# Altium schematic sheet Kill_Switch.SchDoc
size A; SheetNumber: 2; SheetTotal: 6
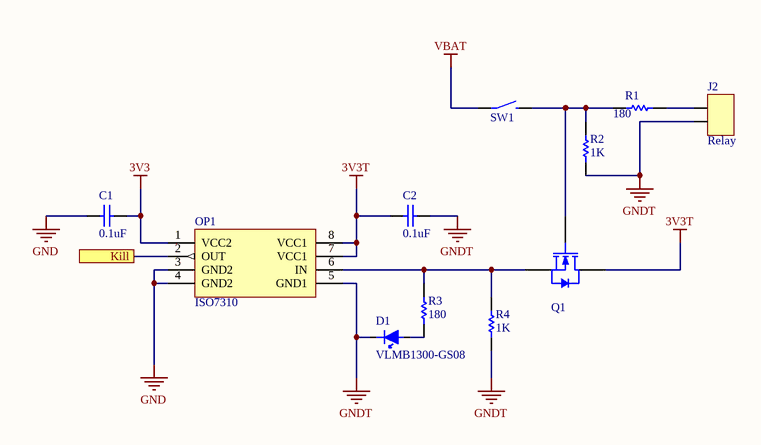
[diagram p0: Kill_Switch.SchDoc]

## Parts
C1  0.1uF  [CAPC1608X97X38NL12T08]
C2  0.1uF  [CAPC1608X97X38NL12T08]
D1  VLMB1300-GS08  [0603 - DIODE]
J2  Relay  [2PinHeader]
OP1  ISO7310  [ISO7310CDR - 8 SOIC]
Q1  MOSFET N-CH  [ONSC-SOT-23-3-318-08_V]  (value not drawn)
R1  180  [RESC1609X55X30NL10T20]
R2  1K  [RESC1609X55X30NL10T20]
R3  180  [RESC1609X55X30NL10T20]
R4  1K  [RESC1609X55X30NL10T20]
SW1  SwitchHeader  [2PinHeader]  (value not drawn)

## Ports
Kill

## Nets
3V3: C1.1 OP1.1(VCC2)
3V3T: C2.1 OP1.7(VCC1) OP1.8(VCC1) Q1.3(D)
GND: C1.2 OP1.3(GND2) OP1.4(GND2)
GNDT: C2.2 D1.C J2.2 OP1.5(GND1) R2.1 R4.1
VBAT: SW1.1
Kill: OP1.2(OUT) ; port Kill
NetD1_A: D1.A R3.1
NetJ2_1: J2.1 R1.2
NetOP1_6: OP1.6(IN) Q1.2(S) R3.2 R4.2
NetQ1_1: Q1.1(G) R1.1 R2.2 SW1.2

## Library data of the parts
C1 C2 = VJ0603Y104KXXAC: CAP CER 0.1UF 25V X7R 0603; Manufacturer: Vitramon; Part Number: VJ0603Y-104KXXAC; Supplier 1: Digi-Key; Supplier Part Number 1: 720-1378-1-ND
D1 = VLMB1300-GS08: Blue 470nm LED Indication - Discrete 3.3V 0603 (1608 Metric); pin to pad: A>1 C>2; Supplier 1: Digi-Key; Supplier Part Number 1: VLMB1300-GS08CT-ND
J2 = 2PinHeader: Supplier 1: Digi-Key; Supplier Part Number 1: 3M9457-36-ND
OP1 = ISO7310CDR - 8SOIC: General Purpose Digital Isolator 3000Vrms 1 Channel 25Mbps 25kV/µs CMTI 8-SOIC (0.154", 3.90mm Width) /; pin to pad: 1>8 2>6 3>7 4>5 5>4 6>2 7>3 8>1; Supplier 1: Digi-Key; Supplier Part Number 1: 296-37994-1-ND
Q1 = BSS138LT1G: MOSFET N-CH 50V 200MA SOT-23; Manufacturer 1: ON Semiconductor; Rds On Max: 3.5R; Max Power Dissipation: 225mW; Input Capacitance: 50pF; Turn-Off Delay Time: 20ns; Gate to Source Voltage (Vgs): 20V; Number of Elements: 1; Element Configuration: Single; Threshold Voltage: 1.5V; Supplier 1: Digi-Key; Supplier Part Number 1: BSS138LT1GOSCT-ND; Manufacturer Part Number 1: BSS138LT1G; Stock 1: 952638; Pricing 1: 1=0.26000, 10=0.21100, 100=0.11210, 500=0.07376, 1000=0.05016 (USD); RoHS: Yes; Case/Package: SOT-23-3; Number of Pins: 3; Contact Plating: Tin,Matte; Min Operating Temperature: -55°C; Max Operating Temperature: 150°C; Packaging: Tape and Reel; Continuous Drain Current (ID): 200mA; Drain to Source Resistance: 3.5R; Package Quantity: 1; Drain to Source Breakdown Voltage: 50V; Power Dissipation: 225mW; Turn-On Delay Time: 20ns; Nominal Vgs: 1.5V; Voltage Rating (DC): 50V; Current Rating: 200mA; On-State Resistance: 3.5R; Length: 3.04mm; Height: 1.01mm; Width: 1.4mm; Radiation Hardening: No; Lead Free: Lead Free; REACH SVHC: No SVHC; Halogen Free: Halogen Free; ComponentLink1URL: https://datasheet.ciiva.com/22641/1596366-22641636.pdf?src-supplier=Element14; ComponentLink1Description: https://datasheet.ciiva.com/22641/1596366-22641636.pdf?src-supplier=Element14; ComponentLink2URL: https://datasheet.ciiva.com/936/bss138lt1-d-936801.pdf?src-supplier=Digi-Key; ComponentLink2Description: https://datasheet.ciiva.com/936/bss138lt1-d-936801.pdf?src-supplier=Digi-Key; ComponentLink3URL: https://datasheet.ciiva.com/936/bss138lt1-d-936802.pdf?src-supplier=Digi-Key; ComponentLink3Description: https://datasheet.ciiva.com/936/bss138lt1-d-936802.pdf?src-supplier=Digi-Key; ComponentLink4URL: https://datasheet.ciiva.com/936/bss138lt1-d-936803.pdf?src-supplier=Digi-Key; ComponentLink4Description: https://datasheet.ciiva.com/936/bss138lt1-d-936803.pdf?src-supplier=Digi-Key; ComponentLink5URL: https://datasheet.ciiva.com/14553/70099493-14553829.pdf?src-supplier=Allied+Electronics; ComponentLink5Description: https://datasheet.ciiva.com/14553/70099493-14553829.pdf?src-supplier=Allied+Electronics; ComponentLink6URL: https://datasheet.ciiva.com/1190/1596366-1190136.pdf?src-supplier=Element14; ComponentLink6Description: https://datasheet.ciiva.com/1190/1596366-1190136.pdf?src-supplier=Element14; ComponentLink7URL: https://datasheet.ciiva.com/1190/1596366-1190137.pdf?src-supplier=Element14; ComponentLink7Description: https://datasheet.ciiva.com/1190/1596366-1190137.pdf?src-supplier=Element14; ComponentLink8URL: https://datasheet.ciiva.com/15198/getdatasheetpartid-110266-15198908.pdf?src-supplier=Verical; ComponentLink8Description: https://datasheet.ciiva.com/15198/getdatasheetpartid-110266-15198908.pdf?src-supplier=Verical; ComponentLink9URL: https://datasheet.ciiva.com/8115/bss138lt1-d-8115358.pdf?src-supplier=Avnet; ComponentLink9Description: https://datasheet.ciiva.com/8115/bss138lt1-d-8115358.pdf?src-supplier=Avnet; ComponentLink10URL: https://datasheet.ciiva.com/8115/bss138lt1-d-8115295.pdf?src-supplier=Avnet; ComponentLink10Description: https://datasheet.ciiva.com/8115/bss138lt1-d-8115295.pdf?src-supplier=Avnet
R1 R3 = TNPW0603180RBEEA: RES 180 OHM 0.1% 1/8W 0603; Tolerance: 1%; Resistance: 1kR; Temperature Coefficient: 25ppm/°C; Power Rating: 100mW; Voltage Rating: 75V; RoHS: Yes; Mount: Surface Mount; Case/Package: 0603; Weight: 7.1E-05oz; Contact Plating: Tin; Case Code (Metric): 1608; Case Code (Imperial): 0603; Min Operating Temperature: -55°C; Max Operating Temperature: 125°C; Composition: Thin Film; Packaging: Tape and Reel; Package Quantity: 1; Number of Terminations: 2; Termination: SMD/SMT; Military Standard: Not; Max Power Dissipation: 100mW; Voltage Rating (DC): 75V; Features: Moisture Resistant,Automotive AEC-Q200,Anti-Sulfur; Length: 1.6mm; Height: 0.45mm; Width: 0.033inch; Depth: 0.85mm; Radiation Hardening: No; REACH SVHC: Unknown; Lead Free: Lead Free; ComponentLink1URL: https://datasheet.ciiva.com/2528/tnpw-e3-2528472.pdf?src-supplier=Digi-Key; ComponentLink1Description: https://datasheet.ciiva.com/2528/tnpw-e3-2528472.pdf?src-supplier=Digi-Key; ComponentLink2URL: https://datasheet.ciiva.com/2528/tnpw-e3-2528473.pdf?src-supplier=Digi-Key; ComponentLink2Description: https://datasheet.ciiva.com/2528/tnpw-e3-2528473.pdf?src-supplier=Digi-Key; ComponentLink3URL: https://datasheet.ciiva.com/9112/tnpw-e3-9112138.pdf?src-supplier=Avnet; ComponentLink3Description: https://datasheet.ciiva.com/9112/tnpw-e3-9112138.pdf?src-supplier=Avnet; ComponentLink4URL: https://datasheet.ciiva.com/16391/tnpw-e3-16391675.pdf?src-supplier=Future+Electronics; ComponentLink4Description: https://datasheet.ciiva.com/16391/tnpw-e3-16391675.pdf?src-supplier=Future+Electronics; ComponentLink5URL: https://datasheet.ciiva.com/9112/tnpw-e3-9112141.pdf?src-supplier=Avnet; ComponentLink5Description: https://datasheet.ciiva.com/9112/tnpw-e3-9112141.pdf?src-supplier=Avnet; ComponentLink6URL: https://datasheet.ciiva.com/16782/70201627-16782047.pdf?src-supplier=Allied+Electronics; ComponentLink6Description: https://datasheet.ciiva.com/16782/70201627-16782047.pdf?src-supplier=Allied+Electronics; Supplier 1: Digi-Key; Supplier Part Number 1: 541-4531-1-ND
R2 R4 = TNPW06031K00BEEA: RES 1K OHM 0.1% 1/8W 0603; Tolerance: 1%; Resistance: 1kR; Temperature Coefficient: 25ppm/°C; Power Rating: 100mW; Voltage Rating: 75V; RoHS: Yes; Mount: Surface Mount; Case/Package: 0603; Weight: 7.1E-05oz; Contact Plating: Tin; Case Code (Metric): 1608; Case Code (Imperial): 0603; Min Operating Temperature: -55°C; Max Operating Temperature: 125°C; Composition: Thin Film; Packaging: Tape and Reel; Package Quantity: 1; Number of Terminations: 2; Termination: SMD/SMT; Military Standard: Not; Max Power Dissipation: 100mW; Voltage Rating (DC): 75V; Features: Moisture Resistant,Automotive AEC-Q200,Anti-Sulfur; Length: 1.6mm; Height: 0.45mm; Width: 0.033inch; Depth: 0.85mm; Radiation Hardening: No; REACH SVHC: Unknown; Lead Free: Lead Free; ComponentLink1URL: https://datasheet.ciiva.com/2528/tnpw-e3-2528472.pdf?src-supplier=Digi-Key; ComponentLink1Description: https://datasheet.ciiva.com/2528/tnpw-e3-2528472.pdf?src-supplier=Digi-Key; ComponentLink2URL: https://datasheet.ciiva.com/2528/tnpw-e3-2528473.pdf?src-supplier=Digi-Key; ComponentLink2Description: https://datasheet.ciiva.com/2528/tnpw-e3-2528473.pdf?src-supplier=Digi-Key; ComponentLink3URL: https://datasheet.ciiva.com/9112/tnpw-e3-9112138.pdf?src-supplier=Avnet; ComponentLink3Description: https://datasheet.ciiva.com/9112/tnpw-e3-9112138.pdf?src-supplier=Avnet; ComponentLink4URL: https://datasheet.ciiva.com/16391/tnpw-e3-16391675.pdf?src-supplier=Future+Electronics; ComponentLink4Description: https://datasheet.ciiva.com/16391/tnpw-e3-16391675.pdf?src-supplier=Future+Electronics; ComponentLink5URL: https://datasheet.ciiva.com/9112/tnpw-e3-9112141.pdf?src-supplier=Avnet; ComponentLink5Description: https://datasheet.ciiva.com/9112/tnpw-e3-9112141.pdf?src-supplier=Avnet; ComponentLink6URL: https://datasheet.ciiva.com/16782/70201627-16782047.pdf?src-supplier=Allied+Electronics; ComponentLink6Description: https://datasheet.ciiva.com/16782/70201627-16782047.pdf?src-supplier=Allied+Electronics; Supplier 1: Digi-Key; Supplier Part Number 1: TNP1.00KAACT-ND
SW1 = SwitchHeader: Supplier 1: Digi-Key; Supplier Part Number 1: 3M9457-36-ND